# EAGLE design tail_light (EAGLE 6.5.0)
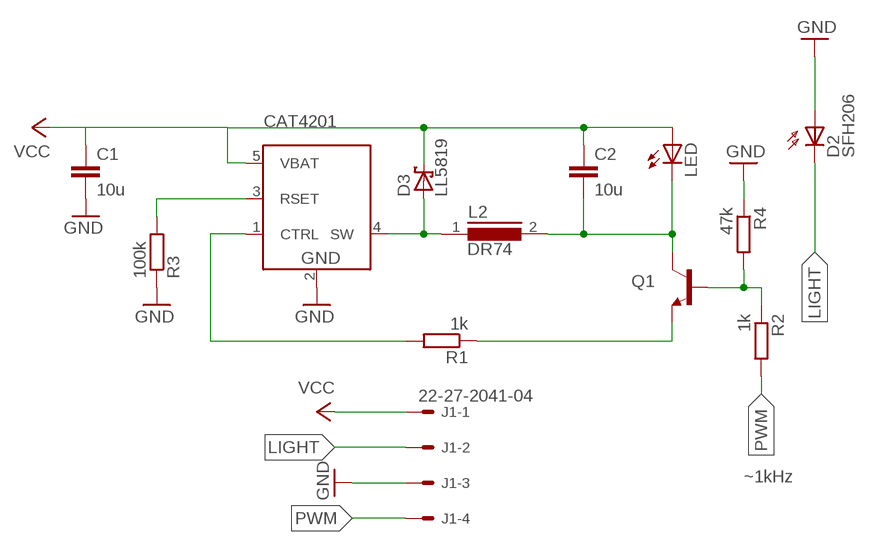
[diagram p0: schematic, sheet 1]

## Parts
C1  10u  C-EUC0805  [C0805]
C2  10u  C-EUC0805  [C0805]
CAT4201  CAT4201TF  [SOT23-DBV]
D2  SFH206  [SFH206]
D3  LL5819  DIODESCHOTTKY  [MELF-MLL41]
J1  22-27-2041-04  [6410-04]
L2  DR74  [DR74]
LED  LEDMINI-TOP  [OSRAM-MINI-TOP-LED]
Q1  TRANSISTOR_NPNSOT23-3  [SOT23-3]
R1  1k  R-EU_R1206  [R1206]
R2  1k  R-EU_R1206  [R1206]
R3  100k  R-EU_R1206  [R1206]
R4  47k  R-EU_R1206  [R1206]

## Nets
GND: C1.2 CAT4201.2(GND) D2.A J1.3 R3.1 R4.1
LED_C: C2.2 L2.2 LED.C Q1.3(C)
LIGHT: D2.K(C) J1.2
N$1: CAT4201.1(CTRL) R1.2
N$2: Q1.1(B) R2.1 R4.2
N$3: Q1.2(E) R1.1
N$5: CAT4201.4(SW) D3.A L2.1
N$6: CAT4201.3(RSET) R3.2
PWM: J1.4 R2.2
VCC: C1.1 C2.1 CAT4201.5(VBAT) D3.C J1.1 LED.A

## Notes on the sheet
- ~1kHz

## Library data of the parts
C1 C2 = resistor:C-EU: CAPACITOR, European symbol
CAT4201 = ShortCircuitRobotics:CAT4201
D2 = opto-trans-siemens:SFH206: PHOTO DIODE; MPN: SFH206K; OC_FARNELL: 1212741; OC_NEWARK: 01M8807
D3 = Brunner:DIODESCHOTTKY
J1 = con-molex:22-?-04: CONNECTOR wire to board 2.54 mm (.1 inch) pitch header; OC_FARNELL: unknown; OC_NEWARK: unknown
L2 = inductors:DR74: High Power Density, High Efficiency, Shielded Inductors Source: coiltronics_dr_series.pdf
LED = led:LED: LED OSRAM: - CHIPLED LG R971, LG N971, LY N971, LG Q971, LY Q971, LO R971, LY R971 LH N974, LH R974 LS Q976, LO Q976, LY Q976 LO Q996 - Hyper CHIPLED LW Q18S LB Q993, LB Q99A, LB R99A - SideLED LS A670, LO A670, LY A670, LG A670, LP A670 LB A673, LV A673, LT A673, LW A673 LH A674 LY A675 LS A676, LA A676, LO A676, LY A676, LW A676 LS A679, LY A679, LG A679 - Hyper Micro SIDELED® LS Y876, LA Y876, LO Y876, LY Y876 LT Y87S - SmartLED LW L88C, LW L88S LB L89C, LB L89S, LG L890 LS L89K, LO L89K, LY L89K LS L896, LA L896, LO L896, LY L896 - TOPLED LS T670, LO T670, LY T670, LG T670, LP T670 LSG T670, LSP T670, LSY T670, LOP T670, LYG T670 LG T671, LOG T671, LSG T671 LB T673, LV T673, LT T673, LW T673 LH T674 LS T676, LA T676, LO T676, LY T676, LB T676, LH T676, LSB T676, LW T676 LB T67C, LV T67C, LT T67C, LS T67K, LO T67K, LY T67K, LW E67C LS E67B, LA E67B, LO E67B, LY E67B, LB E67C, LV E67C, LT E67C LW T67C LS T679, LY T679, LG T679 LS T770, LO T770, LY T770, LG T770, LP T770 LB T773, LV T773, LT T773, LW T773 LH T774 LS E675, LA E675, LY E675, LS T675 LS T776, LA T776, LO T776, LY T776, LB T776 LHGB T686 LT T68C, LB T68C - Hyper Mini TOPLED® LB M676 - Mini TOPLED Santana® LG M470 LS M47K, LO M47K, LY M47K Source: http://www.osram.convergy.de LUXEON: - LUMILED® LXK2-PW12-R00, LXK2-PW12-S00, LXK2-PW14-U00, LXK2-PW14-V00 LXK2-PM12-R00, LXK2-PM12-S00, LXK2-PM14-U00 LXK2-PE12-Q00, LXK2-PE12-R00, LXK2-PE12-S00, LXK2-PE14-T00, LXK2-PE14-U00 LXK2-PB12-K00, LXK2-PB12-L00, LXK2-PB12-M00, LXK2-PB14-N00, LXK2-PB14-P00, LXK2-PB14-Q00 LXK2-PR12-L00, LXK2-PR12-M00, LXK2-PR14-Q00, LXK2-PR14-R00 LXK2-PD12-Q00, LXK2-PD12-R00, LXK2-PD12-S00 LXK2-PH12-R00, LXK2-PH12-S00 LXK2-PL12-P00, LXK2-PL12-Q00, LXK2-PL12-R00 Source: www.luxeon.com KINGBRIGHT: KA-3528ASYC Source: www.kingbright.com
Q1 = SparkFun:TRANSISTOR_NPN: Transistor NPN BJT configuration in SOT23 package. MMBT2222 is the common NPN we use. Double check BCE configuration again layout.
R1 R2 R4 = resistor:R-EU_: RESISTOR, European symbol
R3 = rcl:R-EU_: RESISTOR, European symbol

## Board
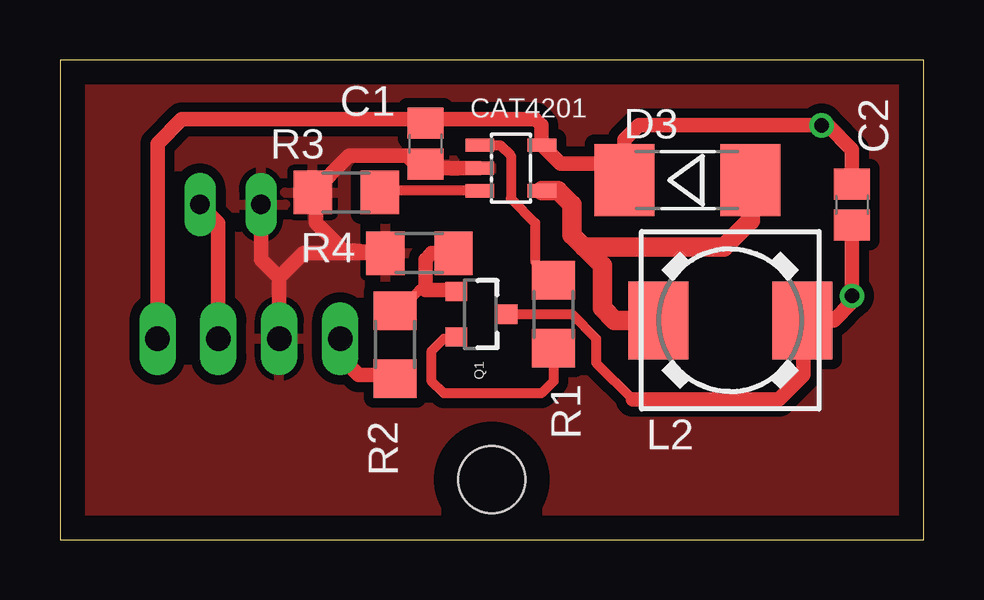
[diagram p1: board, top side]
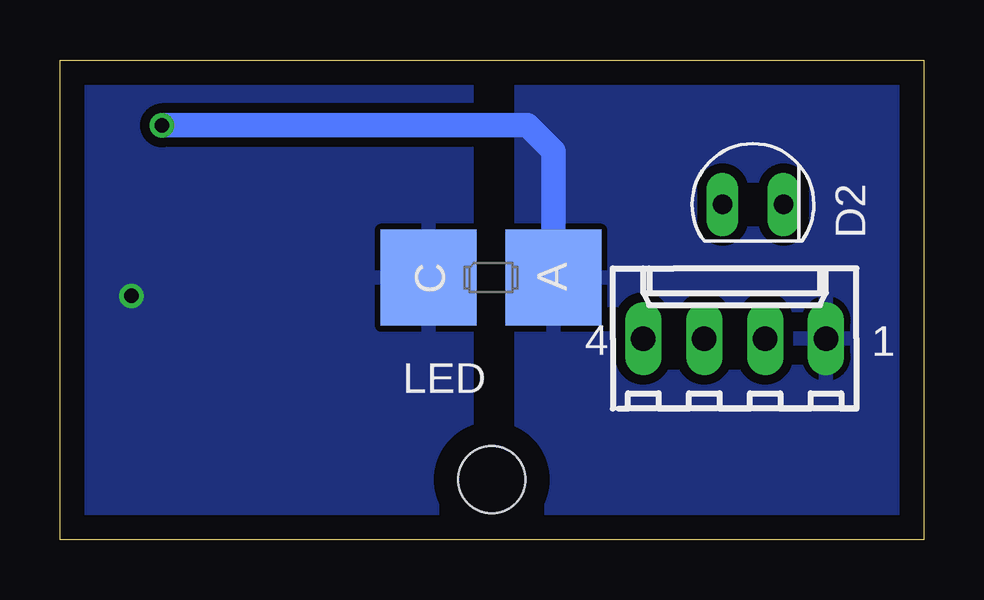
[diagram p2: board, bottom side, seen from below]

Size 36 x 20 mm. Coordinates in mm from the lower left corner, seen from the top.
Outline: 0,0 36,0 36,20 0,20 0,0
Copper layers (1*16): Top 0.035mm / dielectric 1.5mm / Bottom 0.035mm
Design rules "default": minimum track width 10mil, minimum drill 24mil, track to track 8mil, track to pad 8mil, pad to pad 8mil, via to via 8mil, smd to smd 8mil, copper to edge 40mil, drill to drill 8mil, minimum pad ring 10mil, minimum via ring 8mil, stop-mask expansion 4mil, vias tented up to drill 0mil, thermal gap 10mil
Holes 2.8 mm at 18,2.5

### Footprints (pad centres in the part's own frame; a part is rotated, then mirrored left to right if it is on the bottom)
C0805 = smd 1.3 x 1.5: 1 -0.85,0; 2 0.85,0
SOT23-DBV = smd 0.55 x 1.2: 1 -0.95,-1.3; 2 0,-1.3; 3 0.95,-1.3; 4 0.95,1.3; 5 -0.95,1.3
SFH206 = drill 0.813 long: A 0,-1.27; K 0,1.27
MELF-MLL41 = smd 2.5 x 3: A 2.625,0; C -2.625,0
6410-04 = drill 1.016 long: 1 3.81,0; 2 1.27,0; 3 -1.27,0; 4 -3.81,0
DR74 = smd 2.5 x 3.25: 1 -3,0; 2 3,0
OSRAM-MINI-TOP-LED = smd 4 x 4: A 0,2.6; C 0,-2.6
SOT23-3 = smd 0.8 x 0.9: 1 -0.95,-1; 2 0.95,-1; 3 0,1.1
R1206 = smd 1.6 x 1.803: 1 -1.422,0; 2 1.422,0
R1206' = smd 1.6 x 1.8: 1 -1.4,0; 2 1.4,0

### Placement (x,y rotation side)
C1  15.24,16.51 270 top
C2  33.02,13.97 270 top
CAT4201  18.8,15.49 270 top
D2  7.11,13.97 270 bottom
D3  26.16,14.99 0 top
J1  7.87,8.38 0 bottom
L2  27.94,9.14 0 top
LED  18.03,10.92 270 bottom
Q1  17.53,9.4 270 top
R1  20.57,9.4 90 top
R2  13.97,8.13 270 top
R3  100k  [R1206']  11.94,14.48 0 top
R4  14.99,11.94 0 top

### Tracks (layer width: path | path; a pad name or v marks a point on that pad's centre or on a via)
GND
  Top 0.61: CAT4201.2 15.41,15.49 | 15.41,15.49 C1.2 | 15.41,15.49 14.99,15.49 14.48,16 12.06,16 R3.1 10.67,14.35 10.67,13.21 11.79,12.09 R4.1 10.16,11.94 9.14,10.92 | J1.3 9.14,10.92 | D2.A 8.38,11.68 9.14,10.92
  pour Top (isolate 0.406): 0,0 36.07,0 36.07,20.07 0,20.07
LED_C  (via drill 0.6)
  Top 0.406: Q1.3 21.34,9.4 22.35,8.38 22.35,7.37 23.88,5.84
  Top 0.61: C2.2 v33.02,10.16 33.02,9.91 32.26,9.14 L2.2 30.99,9.1 30.99,6.86 29.97,5.84 23.88,5.84
  pour Bottom (isolate 0.406): 19.05,14.22 19.05,20.07 36.07,20.07 36.07,0 19.3,0 19.05,0
LIGHT
  Top 0.61: J1.2 6.6,13.21 D2.K
N$1
  Top 0.406: CAT4201.1 18.35,16.44 18.8,16 18.8,14.22 19.81,13.21 19.81,11.58 R1.2
N$2
  Top 0.406: R2.1 14.12,9.55 14.99,10.41 15.24,10.41 | 16.46,10.41 Q1.1
  Top 0.61: 16.46,10.41 15.24,10.41 15.24,11.68 15.49,11.94 R4.2
N$3
  Top 0.406: R1.1 20.57,6.6 20.07,6.1 16,6.1 15.49,6.6 15.49,7.87 16,8.38 16.46,8.38 Q1.2
N$5
  Top 0.813: L2.1 23.11,9.14 22.61,9.65 22.61,11.43 21.84,12.19 | D3.A 28.79,13.29 27.69,12.19 21.84,12.19 | CAT4201.4 20.76,14.54 21.34,13.97 21.34,12.7 21.84,12.19
N$6
  Top 0.406: CAT4201.3 13.4,14.54 R3.2
PWM
  Top 0.61: J1.4 11.68,7.62 12.45,6.86 13.82,6.86 R2.2
VCC  (via drill 0.6)
  Top 0.61: C2.1 33.02,16.26 32,17.27 v31.75,17.27 24.13,17.27 23.54,16.68 D3.C 23.35,15.68 20.86,15.68 CAT4201.5 20.07,16.47 20.07,17.27 19.81,17.53 15.41,17.53 | 15.41,17.53 C1.1 | J1.1 4.06,16.51 5.08,17.53 15.41,17.53
  Bottom 1.016: LED.A 15.43,16.2 16.51,17.27 v31.75,17.27
  pour Bottom (isolate 0.406): 16.76,13.97 16.76,19.81 0,19.81 0,0 13.97,0 16.76,0